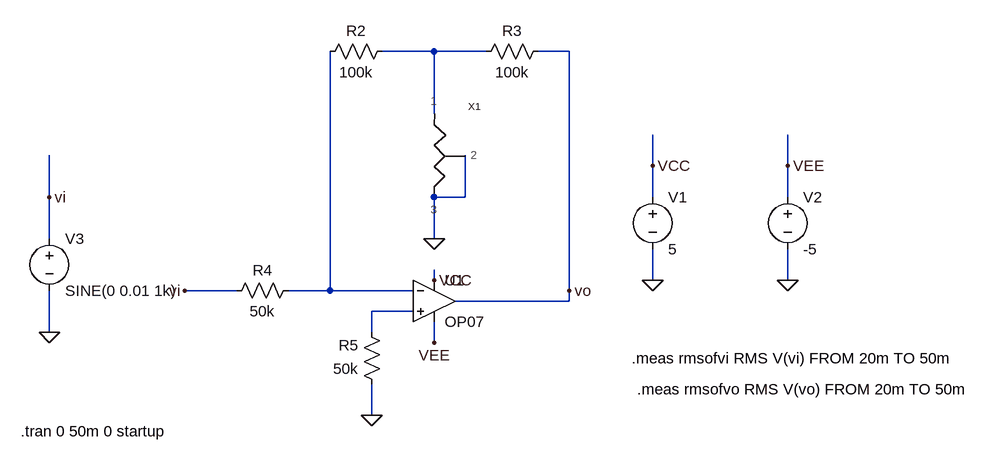
[diagram p0: schematic 2_17.asc]
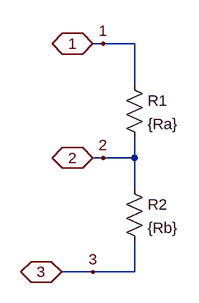
[diagram p1: sub-circuit dian_wei_qi.asc]
2_17.asc, the LTspice schematic file:
Version 4
SHEET 1 1052 680
WIRE 208 -320 128 -320
WIRE 288 -320 208 -320
WIRE 416 -320 368 -320
WIRE 208 -224 208 -320
WIRE 544 -144 544 -192
WIRE 752 -144 752 -192
WIRE -384 -96 -384 -160
WIRE 256 -96 256 -160
WIRE 256 -96 208 -96
WIRE 544 -96 544 -144
WIRE 752 -96 752 -144
WIRE -384 -32 -384 -96
WIRE 208 -32 208 -96
WIRE 208 32 208 16
WIRE 544 32 544 -16
WIRE 752 32 752 -16
WIRE -96 48 -176 48
WIRE 48 48 48 -320
WIRE 48 48 -16 48
WIRE 176 48 48 48
WIRE 416 48 416 -320
WIRE 416 64 416 48
WIRE 416 64 240 64
WIRE 176 80 112 80
WIRE -384 112 -384 48
WIRE 112 112 112 80
WIRE 208 128 208 96
WIRE 112 240 112 192
FLAG 112 240 0
FLAG 208 -32 0
FLAG -176 48 vi
FLAG 416 48 vo
FLAG 544 32 0
FLAG 752 32 0
FLAG 208 32 VCC
FLAG 544 -144 VCC
FLAG 208 128 VEE
FLAG 752 -144 VEE
FLAG -384 112 0
FLAG -384 -96 vi
SYMBOL OpAmps\\OP07 208 0 R0
SYMATTR InstName U1
SYMBOL res 144 -336 R90
WINDOW 0 0 56 VBottom 2
WINDOW 3 32 56 VTop 2
SYMATTR InstName R2
SYMATTR Value 100k
SYMBOL res 384 -336 R90
WINDOW 0 0 56 VBottom 2
WINDOW 3 32 56 VTop 2
SYMATTR InstName R3
SYMATTR Value 100k
SYMBOL res 0 32 R90
WINDOW 0 0 56 VBottom 2
WINDOW 3 32 56 VTop 2
SYMATTR InstName R4
SYMATTR Value 50k
SYMBOL res 128 208 R180
WINDOW 0 36 76 Left 2
WINDOW 3 36 40 Left 2
SYMATTR InstName R5
SYMATTR Value 50k
SYMBOL voltage 544 -112 R0
WINDOW 123 0 0 Left 0
WINDOW 39 0 0 Left 0
SYMATTR InstName V1
SYMATTR Value 5
SYMBOL voltage 752 -112 R0
WINDOW 123 0 0 Left 0
WINDOW 39 0 0 Left 0
SYMATTR InstName V2
SYMATTR Value -5
SYMBOL dian_wei_qi 192 -160 R0
SYMATTR InstName X1
SYMATTR SpiceLine Ra=2.032k,Rb=1
SYMBOL voltage -384 -48 R0
WINDOW 123 0 0 Left 0
WINDOW 39 0 0 Left 0
SYMATTR InstName V3
SYMATTR Value SINE(0 0.01 1k)
TEXT -428 264 Left 2 !.tran 0 50m 0 startup
TEXT 512 152 Left 2 !.meas rmsofvi RMS V(vi) FROM 20m TO 50m
TEXT 520 200 Left 2 !.meas rmsofvo RMS V(vo) FROM 20m TO 50m

dian_wei_qi.asc, the sub-circuit schematic file:
Version 4
SHEET 1 880 680
WIRE 144 -32 128 -32
WIRE 192 -32 144 -32
WIRE 192 32 192 -32
WIRE 144 144 128 144
WIRE 192 144 192 112
WIRE 192 144 144 144
WIRE 192 192 192 144
WIRE 128 320 80 320
WIRE 192 320 192 272
WIRE 192 320 128 320
FLAG 144 -32 1
FLAG 144 144 2
FLAG 128 320 3
FLAG 128 -32 1
IOPIN 128 -32 BiDir
FLAG 128 144 2
IOPIN 128 144 BiDir
FLAG 80 320 3
IOPIN 80 320 BiDir
SYMBOL res 176 16 R0
SYMATTR InstName R1
SYMATTR Value {Ra}
SYMBOL res 176 176 R0
SYMATTR InstName R2
SYMATTR Value {Rb}

The netlist it stands for:
* 2_17.asc
XU1 N003 N002 VCC VEE vo LT1001  ; OP07, pins In+ In- V+ V- OUT
R2 N001 N002 100k
R3 vo N001 100k
R4 N002 vi 50k
R5 0 N003 50k
V1 VCC 0 5
V2 VEE 0 -5
XX1 N001 0 0 dian_wei_qi params: Ra=2.032k,Rb=1
V3 vi 0 SINE(0 0.01 1k)

* block symbol definitions
.subckt dian_wei_qi 1 2 3
R1 1 2 {Ra}
R2 2 3 {Rb}
.ends dian_wei_qi

.tran 0 50m 0 startup
.meas rmsofvi RMS V(vi) FROM 20m TO 50m
.meas rmsofvo RMS V(vo) FROM 20m TO 50m
.lib LTC.lib
.backanno
.end

* Results of the author's LTspice run, read from the files saved beside the schematic
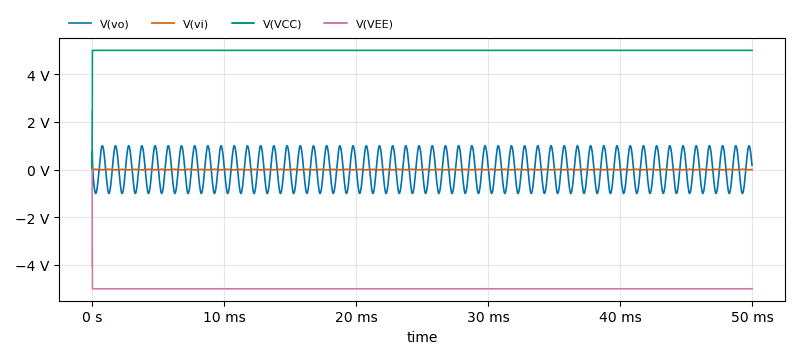
[diagram p2: Transient Analysis of 2_17.asc, plotted from the saved traces]
* Transient Analysis, 1 run:
*   V(vo): min -1.002 V, max 1.002 V, average 400.2 µV, rms 704.7 mV, last 178.8 mV
*   V(vi): min -10 mV, max 10 mV, average 86.59 nV, rms 7.09 mV, last 0 V
*   V(VCC): min 0 V, max 5 V, average 4.999 V, rms 4.999 V, last 5 V
*   V(VEE): min -5 V, max 0 V, average -4.999 V, rms 4.999 V, last -5 V
* From the log:
*   rmsofvi: RMS(v(vi))=0.00703616 FROM 0.02 TO 0.05
*   rmsofvo: RMS(v(vo))=0.699348 FROM 0.02 TO 0.05